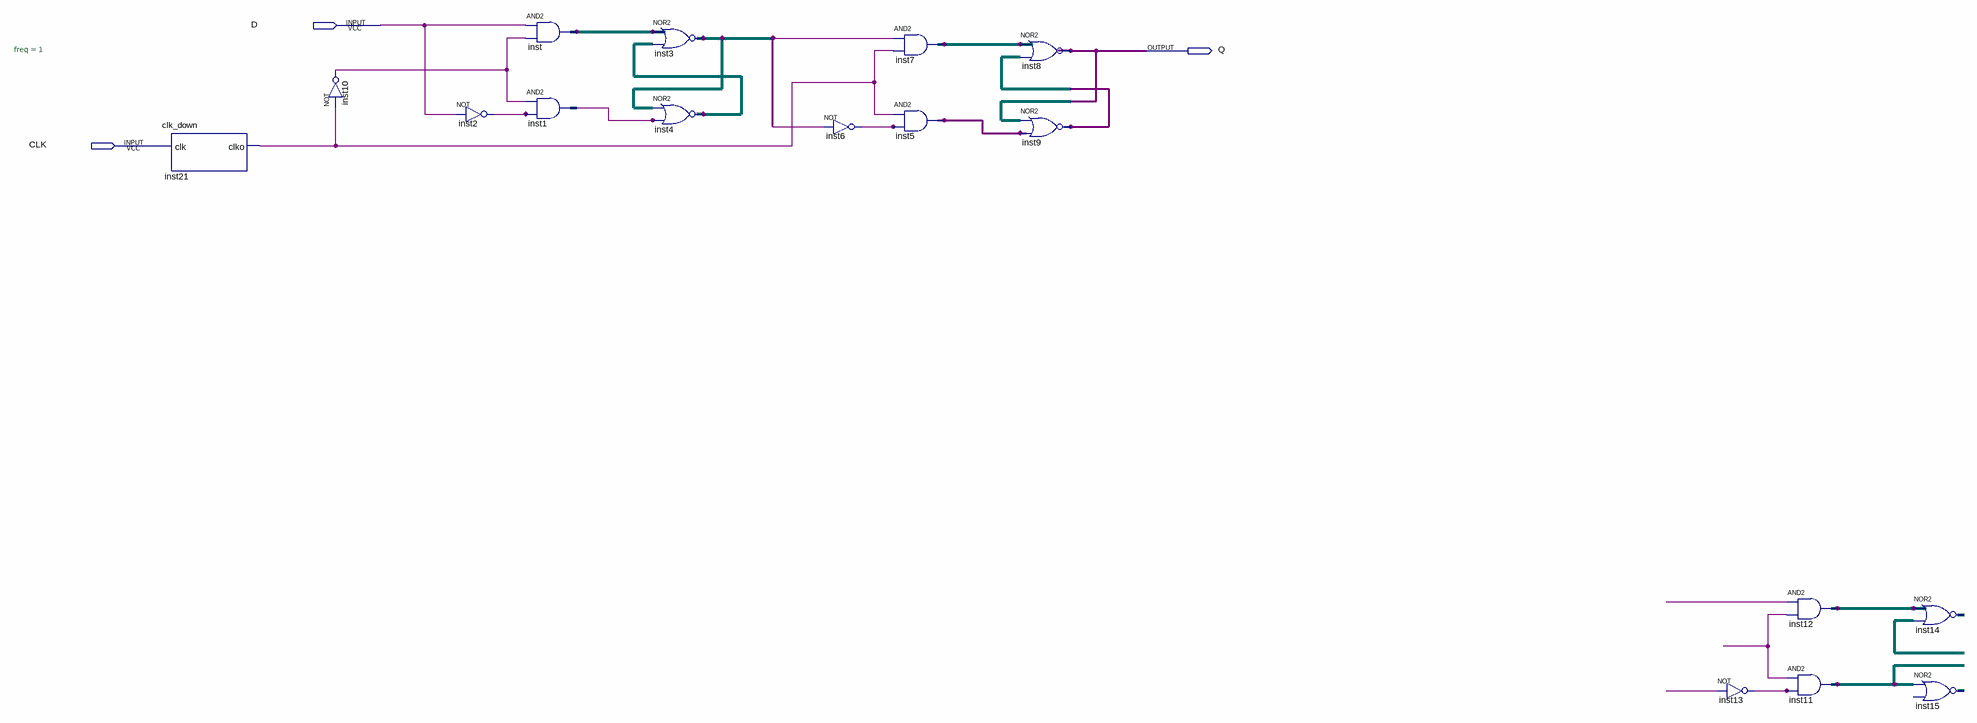
[diagram p0: schematic sheet]
// Quartus schematic LAB04.bdf as structural Verilog: 17 symbols, 3 pins
module LAB04 (
  input  D,
  input  CLK,
  output Q
);

  wire inst1_out, inst2_out, inst5_out, inst6_out, inst9_out, inst10_out, inst13_out, inst21_clko, undriven,
       undriven_2, undriven_3, undriven_4;

  clk_down #(.freq(1)) inst21 (.clk(CLK), .clko(inst21_clko));
  not inst10 (inst10_out, inst21_clko);
  not inst2 (inst2_out, D);
  // AND2 inst has open pins: IN1=D, IN2=inst10_out, OUT=open
  and inst1 (inst1_out, inst10_out, inst2_out);
  // NOR2 inst3 is placed but not wired
  // NOR2 inst4 has open pins: IN1=open, IN2=inst1_out, OUT=open
  not inst6 (inst6_out, undriven);
  // AND2 inst7 has open pins: IN1=undriven, IN2=inst21_clko, OUT=open
  and inst5 (inst5_out, inst21_clko, inst6_out);
  // NOR2 inst8 has open pins: IN1=open, IN2=open, OUT=Q
  not inst9 (inst9_out, inst5_out);  // NOR2 open: IN1
  not inst13 (inst13_out, undriven_4);
  // AND2 inst12 has open pins: IN1=undriven_3, IN2=undriven_2, OUT=open
  // AND2 inst11 has open pins: IN1=undriven_2, IN2=inst13_out, OUT=open
  // NOR2 inst14 is placed but not wired
  // NOR2 inst15 is placed but not wired
endmodule
